# Altium schematic sheet LEDFLX.SchDoc
size C; Date: 23 OCT 2013; DrawnBy: M. DEVOE; Engineer: M. DEVOE; Organization: Altium Limited; Revision: 1
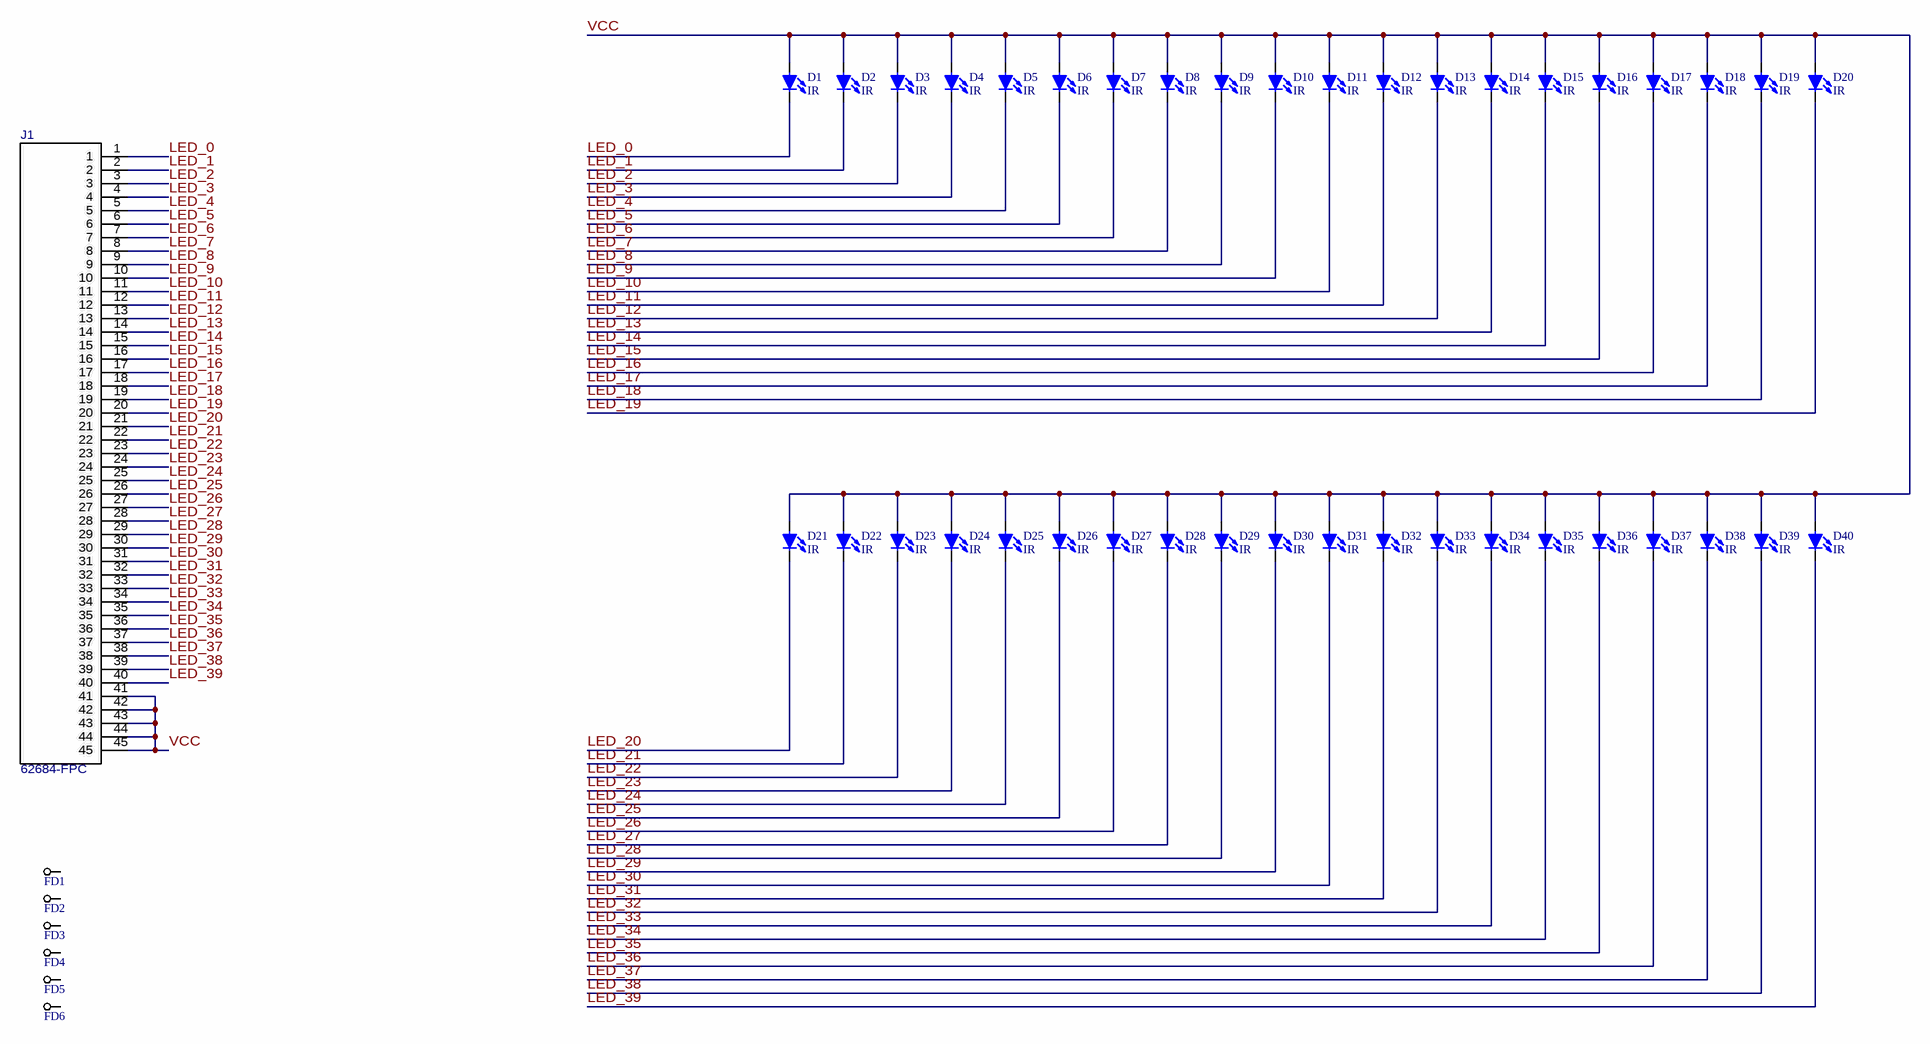
[diagram p0: LEDFLX.SchDoc]

## Parts
D1  Color: IR  [VISHAY_PLCC2_A]  (hidden comment: LED)
D2  Color: IR  [VISHAY_PLCC2_A]  (hidden comment: LED)
D3  Color: IR  [VISHAY_PLCC2_A]  (hidden comment: LED)
D4  Color: IR  [VISHAY_PLCC2_A]  (hidden comment: LED)
D5  Color: IR  [VISHAY_PLCC2_A]  (hidden comment: LED)
D6  Color: IR  [VISHAY_PLCC2_A]  (hidden comment: LED)
D7  Color: IR  [VISHAY_PLCC2_A]  (hidden comment: LED)
D8  Color: IR  [VISHAY_PLCC2_A]  (hidden comment: LED)
D9  Color: IR  [VISHAY_PLCC2_A]  (hidden comment: LED)
D10  Color: IR  [VISHAY_PLCC2_A]  (hidden comment: LED)
D11  Color: IR  [VISHAY_PLCC2_A]  (hidden comment: LED)
D12  Color: IR  [VISHAY_PLCC2_A]  (hidden comment: LED)
D13  Color: IR  [VISHAY_PLCC2_A]  (hidden comment: LED)
D14  Color: IR  [VISHAY_PLCC2_A]  (hidden comment: LED)
D15  Color: IR  [VISHAY_PLCC2_A]  (hidden comment: LED)
D16  Color: IR  [VISHAY_PLCC2_A]  (hidden comment: LED)
D17  Color: IR  [VISHAY_PLCC2_A]  (hidden comment: LED)
D18  Color: IR  [VISHAY_PLCC2_A]  (hidden comment: LED)
D19  Color: IR  [VISHAY_PLCC2_A]  (hidden comment: LED)
D20  Color: IR  [VISHAY_PLCC2_A]  (hidden comment: LED)
D21  Color: IR  [VISHAY_PLCC2_A]  (hidden comment: LED)
D22  Color: IR  [VISHAY_PLCC2_A]  (hidden comment: LED)
D23  Color: IR  [VISHAY_PLCC2_A]  (hidden comment: LED)
D24  Color: IR  [VISHAY_PLCC2_A]  (hidden comment: LED)
D25  Color: IR  [VISHAY_PLCC2_A]  (hidden comment: LED)
D26  Color: IR  [VISHAY_PLCC2_A]  (hidden comment: LED)
D27  Color: IR  [VISHAY_PLCC2_A]  (hidden comment: LED)
D28  Color: IR  [VISHAY_PLCC2_A]  (hidden comment: LED)
D29  Color: IR  [VISHAY_PLCC2_A]  (hidden comment: LED)
D30  Color: IR  [VISHAY_PLCC2_A]  (hidden comment: LED)
D31  Color: IR  [VISHAY_PLCC2_A]  (hidden comment: LED)
D32  Color: IR  [VISHAY_PLCC2_A]  (hidden comment: LED)
D33  Color: IR  [VISHAY_PLCC2_A]  (hidden comment: LED)
D34  Color: IR  [VISHAY_PLCC2_A]  (hidden comment: LED)
D35  Color: IR  [VISHAY_PLCC2_A]  (hidden comment: LED)
D36  Color: IR  [VISHAY_PLCC2_A]  (hidden comment: LED)
D37  Color: IR  [VISHAY_PLCC2_A]  (hidden comment: LED)
D38  Color: IR  [VISHAY_PLCC2_A]  (hidden comment: LED)
D39  Color: IR  [VISHAY_PLCC2_A]  (hidden comment: LED)
D40  Color: IR  [VISHAY_PLCC2_A]  (hidden comment: LED)
FD1  FIDUCIAL  [FIDUCIAL]  (value not drawn)  (no BOM)
FD2  FIDUCIAL  [FIDUCIAL]  (value not drawn)  (no BOM)
FD3  FIDUCIAL  [FIDUCIAL]  (value not drawn)  (no BOM)
FD4  FIDUCIAL  [FIDUCIAL]  (value not drawn)  (no BOM)
FD5  FIDUCIAL  [FIDUCIAL]  (value not drawn)  (no BOM)
FD6  FIDUCIAL  [FIDUCIAL]  (value not drawn)  (no BOM)
J1  62684-FPC  [FCI_62684-FLEX_SIDE]  (no BOM)

## Nets
LED_0: D1.2(C) J1.1
LED_1: D2.2(C) J1.2
LED_2: D3.2(C) J1.3
LED_3: D4.2(C) J1.4
LED_4: D5.2(C) J1.5
LED_5: D6.2(C) J1.6
LED_6: D7.2(C) J1.7
LED_7: D8.2(C) J1.8
LED_8: D9.2(C) J1.9
LED_9: D10.2(C) J1.10
LED_10: D11.2(C) J1.11
LED_11: D12.2(C) J1.12
LED_12: D13.2(C) J1.13
LED_13: D14.2(C) J1.14
LED_14: D15.2(C) J1.15
LED_15: D16.2(C) J1.16
LED_16: D17.2(C) J1.17
LED_17: D18.2(C) J1.18
LED_18: D19.2(C) J1.19
LED_19: D20.2(C) J1.20
LED_20: D21.2(C) J1.21
LED_21: D22.2(C) J1.22
LED_22: D23.2(C) J1.23
LED_23: D24.2(C) J1.24
LED_24: D25.2(C) J1.25
LED_25: D26.2(C) J1.26
LED_26: D27.2(C) J1.27
LED_27: D28.2(C) J1.28
LED_28: D29.2(C) J1.29
LED_29: D30.2(C) J1.30
LED_30: D31.2(C) J1.31
LED_31: D32.2(C) J1.32
LED_32: D33.2(C) J1.33
LED_33: D34.2(C) J1.34
LED_34: D35.2(C) J1.35
LED_35: D36.2(C) J1.36
LED_36: D37.2(C) J1.37
LED_37: D38.2(C) J1.38
LED_38: D39.2(C) J1.39
LED_39: D40.2(C) J1.40
VCC: D1.1(A) D2.1(A) D3.1(A) D4.1(A) D5.1(A) D6.1(A) D7.1(A) D8.1(A) D9.1(A) D10.1(A) D11.1(A) D12.1(A) D13.1(A) D14.1(A) D15.1(A) D16.1(A) D17.1(A) D18.1(A) D19.1(A) D20.1(A) D21.1(A) D22.1(A) D23.1(A) D24.1(A) D25.1(A) D26.1(A) D27.1(A) D28.1(A) D29.1(A) D30.1(A) D31.1(A) D32.1(A) D33.1(A) D34.1(A) D35.1(A) D36.1(A) D37.1(A) D38.1(A) D39.1(A) D40.1(A) J1.41 J1.42 J1.43 J1.44 J1.45

Not connected (* = marked no-connect by the designer): FD1 1; FD2 1; FD3 1; FD4 1; FD5 1; FD6 1

## Notes on the sheet
- DESIGN
- ENGINEERING
- DRAWING
- APPROVED
- DATE
- THIS DOCUMENT IS CONFIDENTIAL AND CONTAINS DESIGNS AND OTHER INFORMATION WHICH ARE THE PROPERTY OF OCULUS AND MAY NOT, IN WHOLE OR IN PART, BE DUPLICATED OR DISCLOSED OR USED FOR THE MANUFACTURE OF THE PART DISCLOSED HEREIN OR FOR ANY OTHER PURPOSE WITHOUT THE PRIOR WRITTEN PERMISSION OF OCULUS.
- DESCRIPTION
- *
- B
- SIZE
- SCH
- TYPE
- DOCUMENT NUMBER
- APPROVED DATE
- VERSION
- SHEET
- of

## Library data of the parts
D1-D40 = LED: Manufacturer: Vishay; ManufacturerPN: VSMY3850
J1 = FCI_62684-FLEX: Manufacturer: FCI; ManufacturerPN: 62684-FPC